# EAGLE design RetinaAdapterBoard (EAGLE 8.6.0)
COMPANY: ADAFRUIT INDUSTRIES; DRAWN: K. TOWNSEND; REV: D
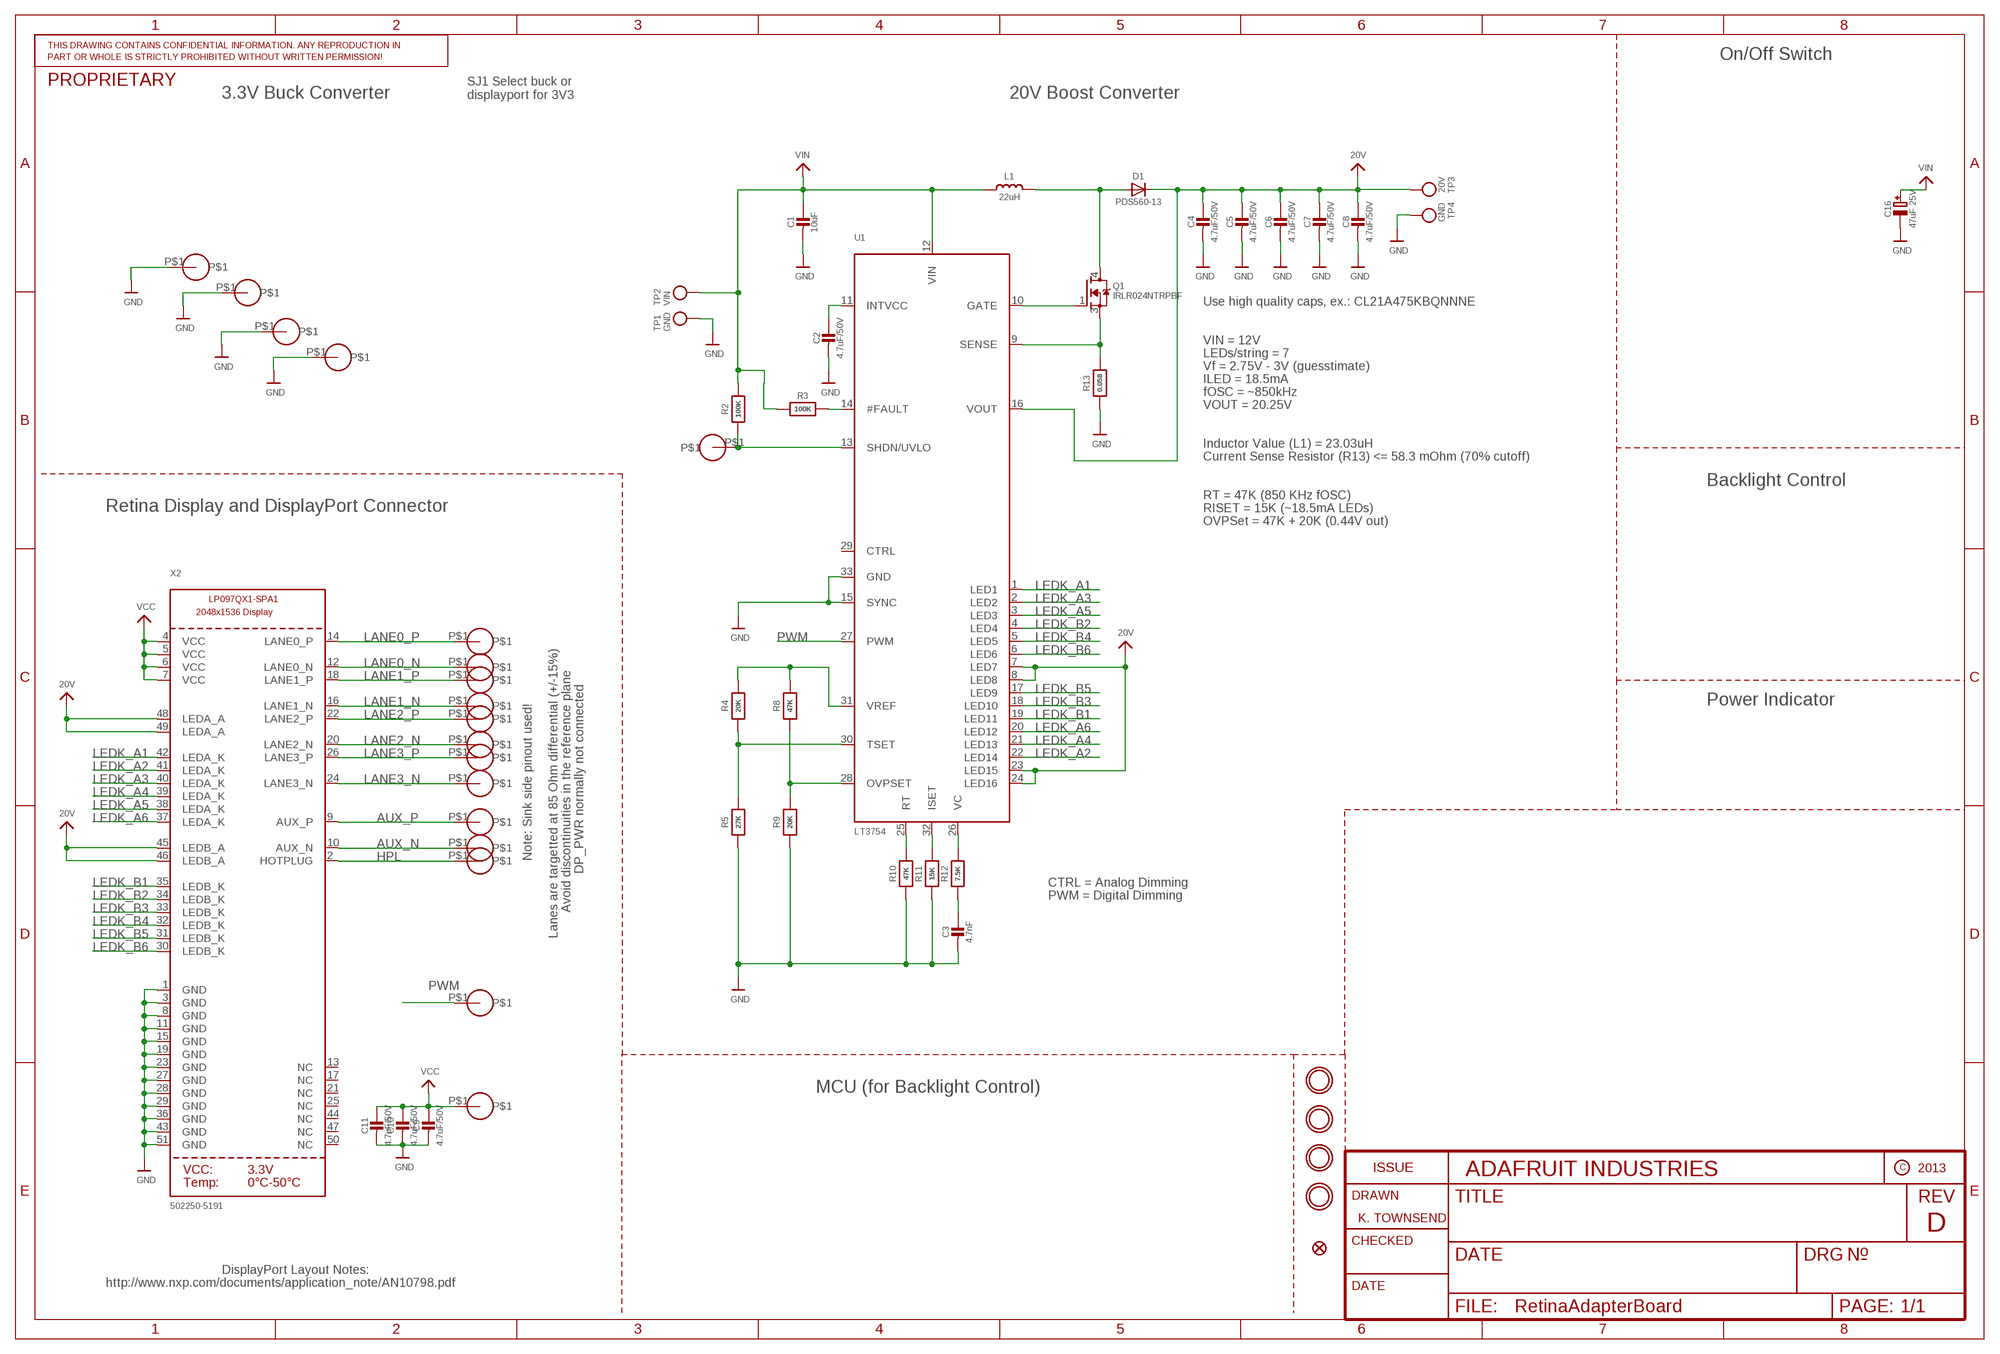
[diagram p0: schematic, sheet 1]

## Parts
C1  10uF  CAP_CERAMIC_0805  [_0805]
C2  4.7uF/50V  CAP_CERAMIC_0805  [_0805]
C3  4.7nF  CAP_CERAMIC_0805  [_0805]
C4  4.7uF/50V  CAP_CERAMIC_0805  [_0805]
C5  4.7uF/50V  CAP_CERAMIC_0805  [_0805]
C6  4.7uF/50V  CAP_CERAMIC_0805  [_0805]
C7  4.7uF/50V  CAP_CERAMIC_0805  [_0805]
C8  4.7uF/50V  CAP_CERAMIC_0805  [_0805]
C9  4.7uF/50V  CAP_CERAMIC_0805  [_0805]
C10  4.7uF/50V  CAP_CERAMIC_0805  [_0805]
C11  4.7uF/50V  CAP_CERAMIC_0805  [_0805]
C16  47uF 25V  CAP_ELECTROLYTICPANASONIC_C  [PANASONIC_C]
D1  PDS560-13  DIODEPOWERDI  [POWERDI-5]
FID3  FIDUCIAL""  [FIDUCIAL_1MM]
L1  22uH  INDUCTORCDRH5D28  [INDUCTOR_6X6MM_SUMIDA_CDRH5D28]
Q1  IRLR024NTRPBF  MOSFET-NDPAK  [DPAK]
R2  100K  RESISTOR_0805  [_0805]
R3  100K  RESISTOR_0805  [_0805]
R4  20K  RESISTOR_0805  [_0805]
R5  27K  RESISTOR_0805  [_0805]
R8  47K  RESISTOR_0805  [_0805]
R9  20K  RESISTOR_0805  [_0805]
R10  47K  RESISTOR_0805  [_0805]
R11  15K  RESISTOR_0805  [_0805]
R12  7.5K  RESISTOR_0805  [_0805]
R13  0.058  RESISTOR2512  [2512]
TP1  GND  TESTPOINTROUND1MM  [TESTPOINT_ROUND_1MM]
TP2  VIN  TESTPOINTROUND1MM  [TESTPOINT_ROUND_1MM]
TP3  20V  TESTPOINTROUND1MM  [TESTPOINT_ROUND_1MM]
TP4  GND  TESTPOINTROUND1MM  [TESTPOINT_ROUND_1MM]
U1  LT3754  VREG_LT3754  [QFN32_5MM]
U$1  SOLDERPAD  [SOLDERPAD]
U$4  SOLDERPAD  [SOLDERPAD]
U$9  SOLDERPAD  [SOLDERPAD]
U$10  SOLDERPAD  [SOLDERPAD]
U$11  MOUNTINGHOLE3.0THIN  [MOUNTINGHOLE_3.0_PLATEDTHIN]
U$13  SOLDERPAD  [SOLDERPAD]
U$15  SOLDERPAD  [SOLDERPAD]
U$32  MOUNTINGHOLE3.0THIN  [MOUNTINGHOLE_3.0_PLATEDTHIN]
U$33  MOUNTINGHOLE3.0THIN  [MOUNTINGHOLE_3.0_PLATEDTHIN]
U$34  MOUNTINGHOLE3.0THIN  [MOUNTINGHOLE_3.0_PLATEDTHIN]
U$43  SOLDERPAD  [SOLDERPAD]
U$46  SOLDERPAD  [SOLDERPAD]
U$47  SOLDERPAD  [SOLDERPAD]
U$48  SOLDERPAD  [SOLDERPAD]
U$49  SOLDERPAD  [SOLDERPAD]
U$50  SOLDERPAD  [SOLDERPAD]
U$51  SOLDERPAD  [SOLDERPAD]
U$52  SOLDERPAD  [SOLDERPAD]
U$53  SOLDERPAD  [SOLDERPAD]
U$54  SOLDERPAD  [SOLDERPAD]
U$55  SOLDERPAD  [SOLDERPAD]
U$57  SOLDERPAD  [SOLDERPAD]
X2  502250-5191  DISP_DISPLAYPORT_LP097QX1-SPA1HANDSOLDERING  [FPC_51PIN_502250-5191_EXT]

## Nets
20V: C4.1 C5.1 C6.1 C7.1 C8.1 D1.C TP3.P$1 U1.7(LED7) U1.8(LED8) U1.16(VOUT) U1.23(LED15) U1.24(LED16) X2.45(LEDB_A) X2.46(LEDB_A) X2.48(LEDA_A) X2.49(LEDA_A)
AUX_N: U$1.P$1 X2.10(AUX_N)
AUX_P: U$43.P$1 X2.9(AUX_P)
GND: C1.2 C2.2 C3.2 C4.2 C5.2 C6.2 C7.2 C8.2 C9.2 C10.2 C11.2 C16.- R5.1 R9.1 R10.1 R11.1 R13.1 TP1.P$1 TP4.P$1 U1.15(SYNC) U1.33(GND) U$10.P$1 U$13.P$1 U$15.P$1 U$55.P$1 X2.1(GND) X2.3(GND) X2.8(GND) X2.11(GND) X2.15(GND) X2.19(GND) X2.23(GND) X2.27(GND) X2.28(GND) X2.29(GND) X2.36(GND) X2.43(GND) X2.51(GND)
HPL: U$54.P$1 X2.2(HOTPLUG)
LANE0_N: U$52.P$1 X2.12(LANE0_N)
LANE0_P: U$53.P$1 X2.14(LANE0_P)
LANE1_N: U$50.P$1 X2.16(LANE1_N)
LANE1_P: U$51.P$1 X2.18(LANE1_P)
LANE2_N: U$48.P$1 X2.20(LANE2_N)
LANE2_P: U$49.P$1 X2.22(LANE2_P)
LANE3_N: U$46.P$1 X2.24(LANE3_N)
LANE3_P: U$47.P$1 X2.26(LANE3_P)
LEDK_A1: U1.1(LED1) X2.42(LEDA_K)
LEDK_A2: U1.22(LED14) X2.41(LEDA_K)
LEDK_A3: U1.2(LED2) X2.40(LEDA_K)
LEDK_A4: U1.21(LED13) X2.39(LEDA_K)
LEDK_A5: U1.3(LED3) X2.38(LEDA_K)
LEDK_A6: U1.20(LED12) X2.37(LEDA_K)
LEDK_B1: U1.19(LED11) X2.35(LEDB_K)
LEDK_B2: U1.4(LED4) X2.34(LEDB_K)
LEDK_B3: U1.18(LED10) X2.33(LEDB_K)
LEDK_B4: U1.5(LED5) X2.32(LEDB_K)
LEDK_B5: U1.17(LED9) X2.31(LEDB_K)
LEDK_B6: U1.6(LED6) X2.30(LEDB_K)
N$9: C2.1 U1.11(INTVCC)
N$10: R2.1 U1.13(SHDN/UVLO) U$9.P$1
N$11: R3.2 U1.14(#FAULT)
N$12: R12.2 U1.26(VC)
N$13: C3.1 R12.1
N$15: R4.1 R5.2 U1.30(TSET)
N$16: R4.2 R8.2 U1.31(VREF)
N$19: R8.1 R9.2 U1.28(OVPSET)
N$20: R10.2 U1.25(RT)
N$22: R11.2 U1.32(ISET)
N$23: Q1.3(S) R13.2 U1.9(SENSE)
N$24: Q1.1(G) U1.10(GATE)
N$25: D1.A1(A) D1.A2(A) L1.P$2 Q1.4(D)
PWM: U1.27(PWM) U$57.P$1
VCC: C9.1 C10.1 C11.1 U$4.P$1 X2.4(VCC) X2.5(VCC) X2.6(VCC) X2.7(VCC)
VIN: C1.1 C16.+ L1.P$1 R2.2 R3.1 TP2.P$1 U1.12(VIN)
Unconnected: U1.29(CTRL) X2.13(NC) X2.17(NC) X2.21(NC) X2.25(NC) X2.44(NC) X2.47(NC) X2.50(NC)

## Notes on the sheet
- On/Off Switch
- 3.3V Buck Converter
- SJ1 Select buck or
  displayport for 3V3
- 20V Boost Converter
- Use high quality caps, ex.: CL21A475KBQNNNE
- VIN = 12V
- LEDs/string = 7
- Vf = 2.75V - 3V (guesstimate)
- ILED = 18.5mA
- fOSC = ~850kHz
- VOUT = 20.25V
- Inductor Value (L1) = 23.03uH
- Current Sense Resistor (R13) <= 58.3 mOhm (70% cutoff)
- Backlight Control
- RT = 47K (850 KHz fOSC)
- Retina Display and DisplayPort Connector | RISET = 15K (~18.5mA LEDs)
- OVPSet = 47K + 20K (0.44V out)
- Power Indicator
- Note: Sink side pinout used!
- DP_PWR normally not connected
- CTRL = Analog Dimming
- PWM = Digital Dimming
- Avoid discontinuities in the reference plane
- Lanes are targetted at 85 Ohm differential (+/-15%)
- MCU (for Backlight Control)
- DisplayPort Layout Notes:
- http://www.nxp.com/documents/application_note/AN10798.pdf

## Library data of the parts
C1-C11 = microbuilder:CAP_CERAMIC: Ceramic Capacitors For new designs, use the packages preceded by an '_' character since they are more reliable: The following footprints should be used on most boards: _0402 - Standard footprint for regular board layouts _0603 - Standard footprint for regular board layouts _0805 - Standard footprint for regular board layouts _1206 - Standard footprint for regular board layouts For extremely tight-pitch boards where space is at a premium, the following 'micro-pitch' footprints can be used (smaller pads, no silkscreen outline, etc.): _0402MP - Micro-pitch footprint for very dense/compact boards _0603MP - Micro-pitch footprint for very dense/compact boards _0805MP - Micro-pitch footprint for very dense/compact boards _1206MP - Micro-pitch footprint for very dense/compact boards
C16 = microbuilder:CAP_ELECTROLYTIC: Electrolytic Capacitors SMT PANASONIC_C - Size C Panasonic Electrolytic Aluminum Capacitor 47µF 16V 20% Electrolytic Capacitor [Digikey: PCE3890TR-ND] PANASONIC_D - Size D Panasonic Electrolytic Aluminum Capacitor 100µF 25V 20% Electrolytic Capacitor [Digikey: PCE3898TR-ND] PTH 3.5 mm grid, 8 mm diameter ... 3.5 mm grid, 10 mm diameter ...
D1 = microbuilder:DIODE: Diode SMA Model Volts Amps Type Vf Ir Digikey # Notes SSA34-E3 40V 3A Schottky 480mV @ 3A 200uA @ 40V SSA34-E3/61TGITR-ND CDBA120-G 20V 1A Schottky 500mV @ 1A 500uA @ 20V 641-1014-6-ND REEL MBRA210 10V 2A Schottky 350mV @ 2A 700uA @ 10V MBRA210LT3 SOD-123 Model Volts Amps Type Vf Ir Order # Notes BAT54T1G 30V 200mA Schottky 800mV @ 200mA 2uA @ 25V BAT54T1GOSTR-ND B0530W 30V 500mA Schottky 430mV @ 500mA 130uA @ 30V B0530W-FDICT-ND REEL MBR120 20V 1A Schottky 340mV @ 1A MBR120VLSFT1GOSCT-ND SOD-323 Model Volts Amps Type Vf Ir Order # Notes PMEG2005EJ 20V 500mA Schottky 355mV @ 500mA 568-4110-1-ND ZLLS410 10V 570mA Schottky 380mV @ 570mA ZLLS410CT-ND 1N4148WS 75V 150mA Silicon/Simple 1V 1N4148WSFSCT-ND REEL SOD-523 Model Volts Amps Type Vf Ir Order # Notes BAT54XV2 30V 200mA Schottky 0.8V @ 100mA BAT54XV2CT-ND TB751S 30V 30mA Schottky RB751S-40TE61CT-ND SOT23-R/W (R = Solder Paste/Reflow Ovens, W = Hand-Soldering) Model Volts Amps Type Vf Ir Order # Notes BAT54FILM 40V 300mA Schottky 497-7162-1-ND POWERDI-5 Model Volts Amps Type Vf Ir Order # Notes PDS560 60V 5A Schottky 670mV @ 5A 150uA @ 60V PDS560DICT-ND
FID3 = microbuilder:FIDUCIAL: Fiducial Alignment Points Various fiducial points for machine vision alignment.; BOM: EXCLUDE
L1 = microbuilder:INDUCTOR: Inductors 0603: 10nH Ceramic Inductor - microwire antenna/RF (Digikey: 712-1434-2-ND) 0805: 560nH Ceramic Inductor - RF (Digikey: 553-1047-1-ND) 270nH Ceramic Inductor - Q = 40@250MHz, +-5%, 1 Ohm DC Resistance (Digikey: 535-10506-2-ND) 1007 (2518 Metric) SMT: 10µH 10% 250mOhm 820mA 1007 Inductor (Digikey: 587-2189-1-ND) 22µH 10% 500mOhm 580mA 1007 Inductor (Digikey: 587-2190-1-ND) 47µH 10% 950mOhm 420mA 1007 Inductor (Digikey: 587-2191-1-ND) 47µH 5% 100mOhm 1A 1008 Inductor (Digikey: 732-1816-1-ND) 5.0x5.0mm (Taiyo Yuden NR5040 Series) 6.8µH 20% 2.3A 64mOhm Inductor (Digikey: 587-2374-2-ND) 5.0x5.0mm (TDK VLC5045 Series) 4.7µH 20% 3.3A 34mOhm Inductor (Digikey: 445-6526-1-ND) 6.8µH 20% 2.7A 46mOhm Inductor (Digikey: 445-6527-1-ND) 6.0x6.0mm (TDK VLC6045 Series) 4.7µH 20% 3.8A 27mOhm Inductor (Digikey: 445-6538-2-ND) 6.8µH 20% 3A 41mOhm Inductor (Digikey: 445-6540-1-ND) 6.2µH 30% 2.2A 45mOhm Inductor (Digikey: SRR5028-6R2YCT-ND) - Not TDK VLC6045 but footprint should match 6.0x6.0mm (TDK SLF6045 Series) 6.8uH 30% 2A 33mOhm Inductor (Digikey: 445-4572-1-ND, Mouser: 810-SLF645T6R8N2R0PF) 6.0x6.0mm (Sumida CDRH5D28 Series) 6.2uH 30% 1.8A 45mOhm Inductor (Digikey: 308-1542-1-ND) Taiyo Yuden NR3015T2R2M - 2.2uH 20% 1.5A (Digikey: 587-1648-2-ND, Mouser: 963-NR3015T2R2M) - Used with TI TPS62172 CoilCraft RFID Transponder Coil - MA5532-AE (For use with AS3935 Lightning Sensor)
Q1 = microbuilder:MOSFET-N: N-Channel Mosfet LEGEND VDS: Voltage Drain-Source ID: Drain Current RDS(ON): Drain-Source On-State Resistance VGS(TH): Gate-Source Threshold Voltage CISS: Drain-Source Input Capacitance SOT-23 Name VDS ID RDS(ON) VGS(TH) CISS Order Number 2N7002E 60V 260mA 2.5 Ohm 2.5V @ 250uA 26.7pF @ 25V 2N7002ET1GOSTR-ND BSH103 30V 850mA 400 mOhm 400mV @ 1mA 83pF @ 24V BSH103,235-ND BSS138 60V 320mA 1.6 Ohm 1.5V @ 250uA 50pF @ 10V Mouser: 771-BSS138PW115 DMN2075U-7 20V 4.2A 38 mOhm 1V @ 250 uA 594.3pF @ 10V DMN2075U-7DICT-ND * BSS138 good choice for I2C level-shifting POWERPAK 1212-8 Name VDS ID RDS(ON) VGS(TH) CISS Order Number Si7308DN 60V 6A 58 mOhm 3V @ 250uA 665pF @ 15V SI7308DN-T1-E3CT-ND
R2-R5 R8-R13 = microbuilder:RESISTOR: Resistors For new designs, use the packages preceded by an '_' character since they are more reliable: The following footprints should be used on most boards: _0402 - Standard footprint for regular board layouts _0603 - Standard footprint for regular board layouts _0805 - Standard footprint for regular board layouts _1206 - Standard footprint for regular board layouts For extremely tight-pitch boards where space is at a premium, the following 'micro-pitch' footprints can be used (smaller pads, no silkscreen outline, etc.): _0402MP - Micro-pitch footprint for very dense/compact boards _0603MP - Micro-pitch footprint for very dense/compact boards _0805MP - Micro-pitch footprint for very dense/compact boards _1206MP - Micro-pitch footprint for very dense/compact boards
TP1-TP4 = microbuilder:TESTPOINT: Test Point Various test points for characterisation and PCB testing TESTPOINT_SMT - Compact Surface Mount Test Point [Digikey: 5016KTR-ND]
U1 = microbuilder:VREG_LT3754: LT3754 - 16-Channel x 50mA per LED Boost 6V to 40V Input Up to 45V Output (per channel) Single resistor sets current (10-50mA)
U$1 U$4 U$9 U$10 U$13 U$15 U$43 U$46-U$55 U$57 = solderpad:SOLDERPAD
U$11 U$32-U$34 = microbuilder:MOUNTINGHOLE: Mounting Hole For #2 screws (0.086"/2.18mm width, 0.094"/2.4mm hole) use 2.5mm; BOM: EXCLUDE
X2 = microbuilder:DISP_DISPLAYPORT_LP097QX1-SPA1: Connector: Molex 502250-5191

## Net classes
0 default: width 0.152 mm

## Board
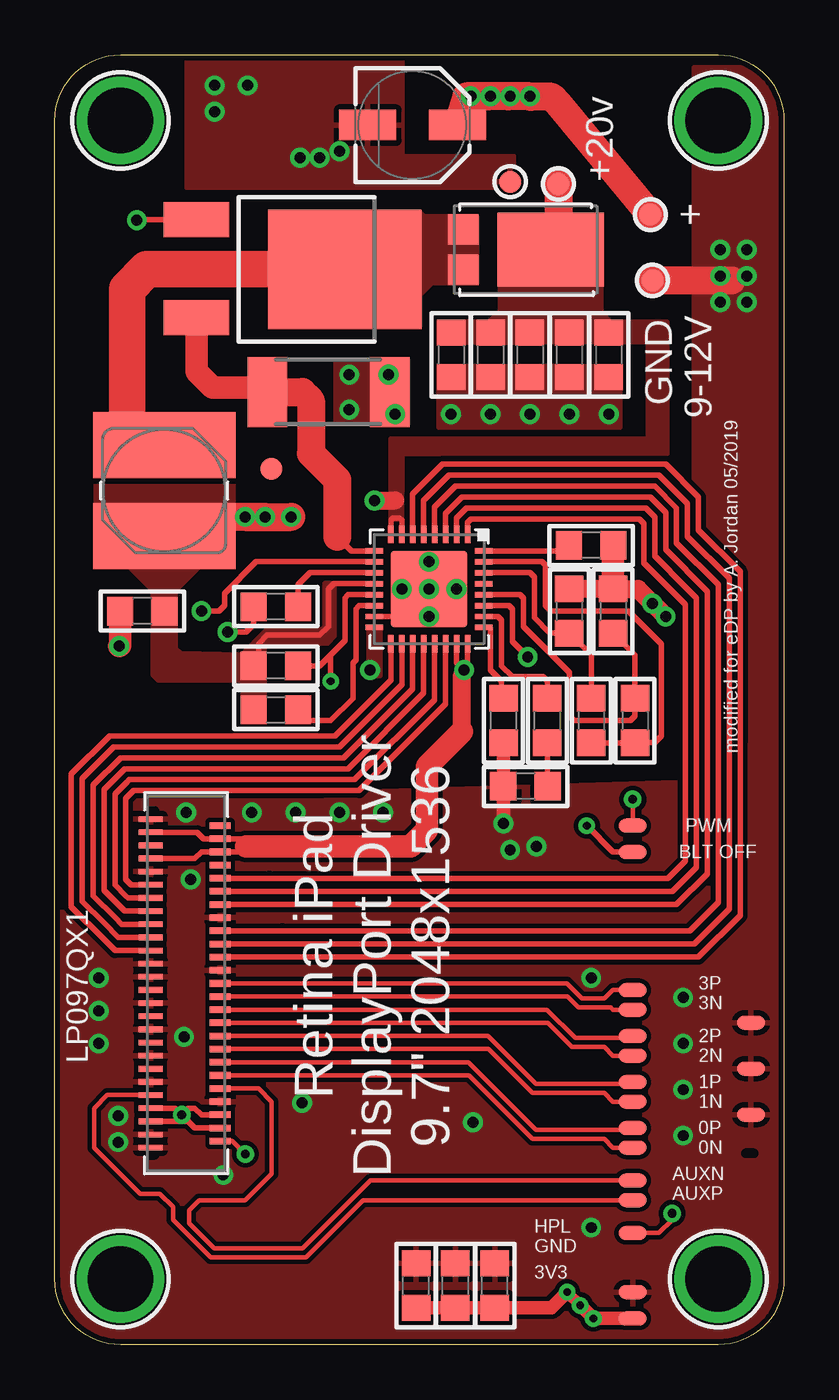
[diagram p1: board, top side]
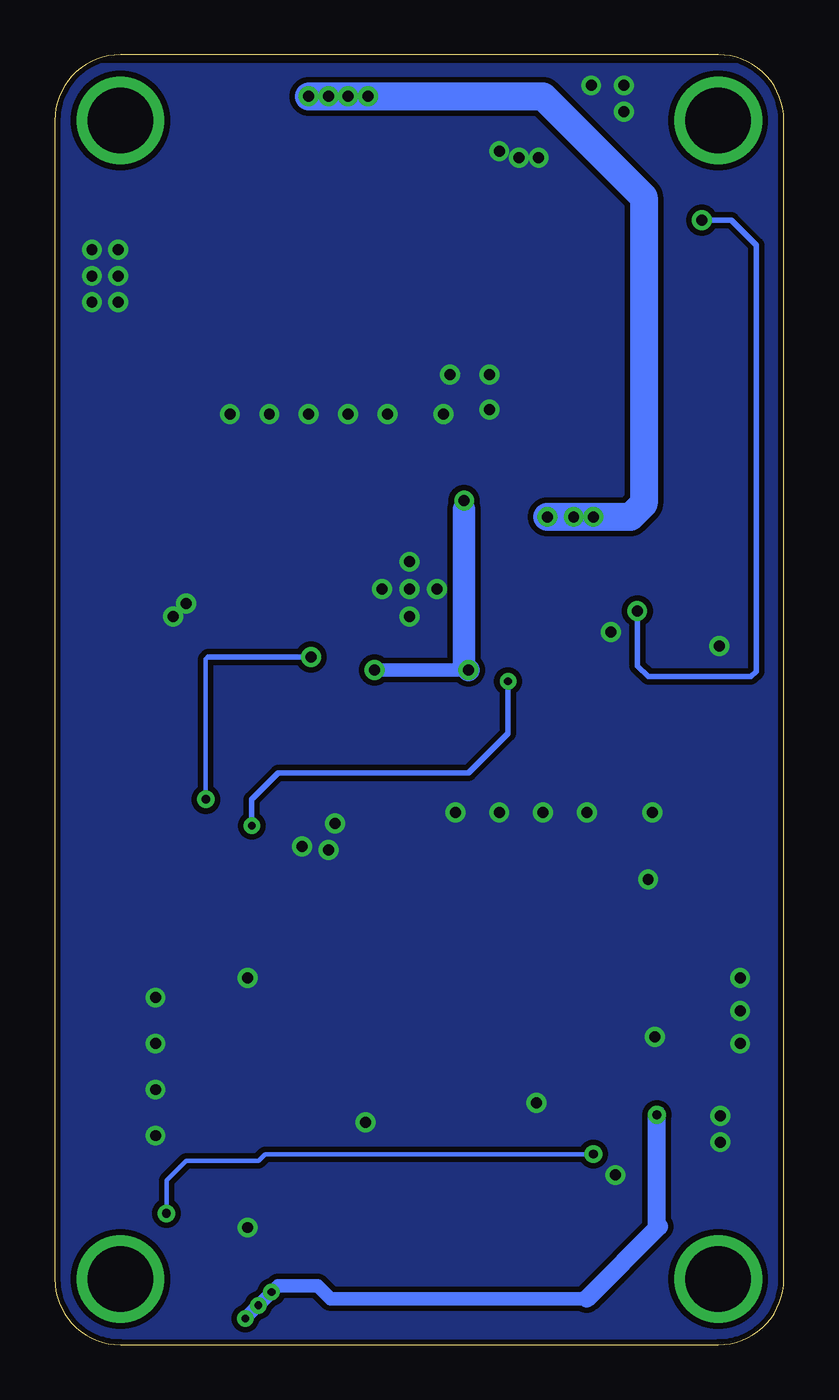
[diagram p2: board, bottom side, seen from below]

Size 33.3 x 58.9 mm. Coordinates in mm from the lower left corner, seen from the top.
Outline: 0,3 0,55.9 arc-90 3,58.9 30.3,58.9 arc-90 33.3,55.9 33.3,3 arc-90 30.3,0 3,0 arc-90 0,3
Copper layers (1*16): Top 0.035mm / dielectric 1.5mm / Bottom 0.035mm
Design rules "adafruit": minimum track width 8mil, minimum drill 15.5mil, track to track 8mil, track to pad 8mil, pad to pad 8mil, via to via 8mil, smd to smd 8mil, copper to edge 10mil, drill to drill 8mil, minimum pad ring 10mil, minimum via ring 8mil, stop-mask expansion 4mil, vias tented up to drill 20mil, thermal gap 10mil
tRestrict: area 31.5,8.7 to 31.9,8.8; area 4.2,17.1 to 4.5,17.1; area 4.2,24.3 to 4.6,24.4; area 4.2,9.3 to 4.6,9.4; area 4.2,8.7 to 4.6,8.7

### Footprints (pad centres in the part's own frame; a part is rotated, then mirrored left to right if it is on the bottom)
_0805 = smd 1.2 x 1.3: 1 -1.016,0; 2 1.016,0
PANASONIC_C = smd 2.6 x 1.4: + 2.05,0; - -2.05,0
POWERDI-5 = smd 1.39 x 1.4: A1 -0.92,-2.84; A2 0.92,-2.84 | smd 3.36 x 4.86: C 0,1.142
FIDUCIAL_1MM = smd 1 x 1: 1 0,0
INDUCTOR_6X6MM_SUMIDA_CDRH5D28 = smd 3 x 6.5: P$1 -2.075,0; P$2 2.075,0
DPAK = smd 1.6 x 2.997: 1 -2.261,-4.928; 3 2.21,-4.928 | smd 5.452 x 7: 4 0,1.853
2512 = smd 1.8 x 3.2: 1 -2.8,0; 2 2.8,0
TESTPOINT_ROUND_1MM = smd 1 x 1: P$1 0,0
QFN32_5MM = smd 0.8 x 0.25: 1 -2.5,1.75; 2 -2.5,1.25; 3 -2.5,0.75; 4 -2.5,0.25; 5 -2.5,-0.25; 6 -2.5,-0.75; 7 -2.5,-1.25; 8 -2.5,-1.75; 17 2.5,-1.75; 18 2.5,-1.25; 19 2.5,-0.75; 20 2.5,-0.25; 21 2.5,0.25; 22 2.5,0.75; 23 2.5,1.25; 24 2.5,1.75 | smd 0.25 x 0.8: 9 -1.75,-2.5; 10 -1.25,-2.5; 11 -0.75,-2.5; 12 -0.25,-2.5; 13 0.25,-2.5; 14 0.75,-2.5; 15 1.25,-2.5; 16 1.75,-2.5; 25 1.75,2.5; 26 1.25,2.5; 27 0.75,2.5; 28 0.25,2.5; 29 -0.25,2.5; 30 -0.75,2.5; 31 -1.25,2.5; 32 -1.75,2.5 | smd 3.5 x 3.5: 33 0,0
SOLDERPAD = smd 0.635 x 1.27: P$1 0,0
MOUNTINGHOLE_3.0_PLATEDTHIN = drill 3 pad 3.6: P$1 0,0
FPC_51PIN_502250-5191_EXT = smd 0.26 x 1.1: 1 7.5,-1.625; 3 6.9,-1.625; 5 6.3,-1.625; 7 5.7,-1.625; 9 5.1,-1.625; 11 4.5,-1.625; 13 3.9,-1.625; 15 3.3,-1.625; 17 2.7,-1.625; 19 2.1,-1.625; 21 1.5,-1.625; 23 0.9,-1.625; 25 0.3,-1.625; 27 -0.3,-1.625; 29 -0.9,-1.625; 31 -1.5,-1.625; 33 -2.1,-1.625; 35 -2.7,-1.625; 37 -3.3,-1.625; 39 -3.9,-1.625; 41 -4.5,-1.625; 43 -5.1,-1.625; 45 -5.7,-1.625; 47 -6.3,-1.625; 49 -6.9,-1.625; 51 -7.5,-1.625 | smd 0.3 x 0.95: 2 7.2,1.55; 4 6.6,1.55; 6 6,1.55; 8 5.4,1.55; 10 4.8,1.55; 12 4.2,1.55; 14 3.6,1.55; 16 3,1.55; 18 2.4,1.55; 20 1.8,1.55; 22 1.2,1.55; 24 0.6,1.55; 26 0,1.55; 28 -0.6,1.55; 30 -1.2,1.55; 32 -1.8,1.55; 34 -2.4,1.55; 36 -3,1.55; 38 -3.6,1.55; 40 -4.2,1.55; 42 -4.8,1.55; 44 -5.4,1.55; 46 -6,1.55; 48 -6.6,1.55; 50 -7.2,1.55

### Placement (x,y rotation side)
C1  4,33.5 180 top
C2  10.1,33.7 180 top
C3  21.5,25.5 180 top
C4  18.1,45.2 270 top
C5  19.9,45.2 270 top
C6  21.7,45.2 270 top
C7  23.5,45.2 270 top
C8  25.3,45.2 270 top
C9  18.3,2.7 90 top
C10  20.1,2.7 90 top
C11  16.5,2.7 90 top
C16  16.34,55.69 0 top
D1  21.5,50 270 top
FID3  9.9,40 0 top
L1  5,39 90 top
Q1  11.4,49.1 270 top
R2  10.1,31 180 top
R3  10.1,29 0 top
R4  24.5,28.5 270 top
R5  23.5,33.5 270 top
R8  26.5,28.5 270 top
R9  25.5,33.5 270 top
R10  20.5,28.5 90 top
R11  24.5,36.5 180 top
R12  22.5,28.5 90 top
R13  12.5,43.5 180 top
TP1  20.8,53.1 90 top
TP2  27.2,51.6 90 top
TP3  23,53 90 top
TP4  27.3,48.6 90 top
U1  17.1,34.5 270 top
U$1  26.4,7.5 90 top
U$4  26.4,1.2 90 top
U$9  26.4,22.5 90 top
U$10  31.8,14.7 90 top
U$11  30.3,3 0 top
U$13  31.8,12.6 90 top
U$15  31.8,10.5 90 top
U$32  30.3,55.9 0 top
U$33  3,55.9 0 top
U$34  3,3 0 top
U$43  26.4,6.6 90 top
U$46  26.4,15.3 270 top
U$47  26.4,16.2 90 top
U$48  26.4,13.2 90 top
U$49  26.4,14.1 90 top
U$50  26.4,11.1 90 top
U$51  26.4,12 90 top
U$52  26.4,9 90 top
U$53  26.4,9.9 90 top
U$54  26.4,5.1 90 top
U$55  26.4,2.4 90 top
U$57  26.4,23.7 90 top
X2  6,16.5 270 top

### Tracks (layer width: path | path; a pad name or v marks a point on that pad's centre or on a via)
20V  (via drill 0.5)
  Top 0.25: X2.49 6.5,23.4 6.8,23.1 X2.48 | X2.45 6.4,22.2 6.7,22.5 X2.46
  Top 0.254: X2.46 8.75,22.5 8.75,22.75 8.65,23.1 | X2.48 9.15,23.1 9.5,22.75 | 18.35,30.65 18.6,30.6 | U1.8 15.35,37.65 15.45,37.75 15.75,37.75 15.85,37.65 U1.7 | U1.24 18.85,30.95 v18.7,30.8 18.35,31.15 U1.23
  Top 0.61: v18.7,30.8 18.7,30.7 18.6,30.6
  Top 0.813: 18.6,28 18.6,30.6 | v14.6,38.55 15.55,38.55
  Top 1.016: 8.75,22.75 9.5,22.75 16.25,22.75 17,23.5 17,26.4 18.6,28
  Top 1.27: TP3.P$1 23,50.36 D1.C
  Bottom 0.61: v18.7,30.8 v14.4,30.8
  Bottom 0.813: 14.6,38.15 v14.6,38.55
  Bottom 1.016: 14.6,38.15 14.6,31 v14.4,30.8
  pour Top (isolate 0.254, no thermals): 17.55,45.75 27.1,45.8 27.1,41.35 15.35,41.35 15.35,37.7 15.85,37.7 15.85,40.7 27.95,40.7 27.95,46.7 25.35,46.7 24.95,47.1 24.95,51.55 20.35,51.55 20.35,47.2 19.85,46.7 17.55,46.7
  pour Top (isolate 0.254, no thermals): 14.35,32.75 14.85,32.75 14.85,30.55 14.35,30.55
AUX_N
  Top 0.203: U$1.P$1 14.41,7.5 11.32,4.4 7.28,4.4 6.14,5.54 6.14,6.14 6.6,6.6 8.7,6.6 9.9,7.8 9.9,11.1 9.3,11.7 X2.10
AUX_P
  Top 0.203: U$43.P$1 14.09,6.6 11.48,4 7.12,4 5.4,5.71 5.4,6.3 4.8,6.9 3.9,6.9 1.8,9 1.8,10.8 2.4,11.4 X2.9
GND  (via drill 0.5)
  Top 0.254: C2.2 9.08,32.88 8.75,32.55 v7.9,32.55 | U1.15 v17.1,33.25 | v11.2,54.2 11.2,54.1 11.1,54
  Top 0.508: v27.3,33.85 v27.9,33.25
  Top 0.61: R10.1 20.5,25.52 C3.2 20.48,23.82 v20.5,23.8
  Top 0.813: v27.9,33.25 26.63,34.52 R9.1 R5.1
  Top 1.016: C1.2 2.98,31.93 v2.95,31.9 | R9.1 25.5,36.48 R11.1
  Top 1.27: TP4.P$1 30.9,48.6
  other vias: 22,22.75 2,16.75 2,15.25 2,13.75 6,24.3 18.1,42.5 19.9,42.5 21.7,42.5 23.5,42.5 13.45,44.3 13.45,42.7 9,24.3 11,24.3 13,24.3 15,24.3 25.3,42.5 17.1,34.5 17.1,35.75 15.85,34.5 18.35,34.5 2.9,10.45 2.9,9.25 7.7,7.75 28.7,15.85 28.7,13.75 28.7,11.65 28.7,9.55 24.5,5.35 5.9,14.05 6.2,21.25 24.5,16.75 11.3,11.05 19.1,10.15 15.25,44.3 15.55,42.5 12.1,54.2 13,54.5 7.3,57.5 7.3,56.3 8.8,57.5 30.4,50 30.4,48.8 30.4,47.6 31.6,50 31.6,48.8 31.6,47.6 20.8,22.6
  pour Bottom (isolate 0.254): 0,58.4 33.3,58.4 33.3,0 0,0
  pour Top (isolate 0.254, no thermals): 17.55,44.65 25.8,44.65 25.8,41.9 17.55,41.9
  pour Top (isolate 0.254, no thermals): 12.85,44.95 16.1,44.95 16.1,42.05 12.85,42.05
  pour Top (isolate 0.21): 0,3 0,24.8 29.2,25.7 29.2,58.3 33.3,58.3 33.3,3 arc-90 30.3,0 3,0 arc-90
  pour Top: 6,62.1 6,52.8 21,52.8 21,54.3 15.9,54.3 15.9,62.4 6,62.4
HPL  (via drill 0.39)
  Top 0.203: X2.2 8.1,9.3 v8.7,8.7 | v28.2,6 28.2,5.7 27.6,5.1 U$54.P$1
  Bottom 0.203: v8.7,8.7 23.7,8.7 24,8.4 27.3,8.4 28.2,7.5 v28.2,6
LANE0_N
  Top 0.203: X2.12 18.91,12.3 21.82,9.4 25.1,9.4 25.5,9 U$52.P$1
LANE0_P
  Top 0.203: X2.14 18.89,12.9 21.98,9.8 26.3,9.8 U$53.P$1
LANE1_N
  Top 0.203: X2.16 19.81,13.5 21.82,11.5 25.1,11.5 25.5,11.1 U$50.P$1
LANE1_P
  Top 0.203: X2.18 19.79,14.1 21.98,11.9 26.3,11.9 U$51.P$1
LANE2_N
  Top 0.203: X2.20 22.51,14.7 23.62,13.6 25.1,13.6 25.5,13.2 U$48.P$1
LANE2_P
  Top 0.203: X2.22 22.49,15.3 23.78,14 26.3,14 U$49.P$1
LANE3_N
  Top 0.203: X2.24 23.41,15.9 23.92,15.4 25.4,15.4 25.5,15.3 U$46.P$1
LANE3_P
  Top 0.203: X2.26 23.39,16.5 24.08,15.8 25.1,15.8 25.5,16.2 U$47.P$1
LEDK_A1
  Top 0.254: X2.42 9.8,21.3 17.75,21.3 28,21.3 28.8,22.1 28.8,27.5 28.8,33.8 26.9,35.7 26.9,37.5 26.7,37.7 19,37.7 18.85,37.55 U1.1
LEDK_A2
  Top 0.254: X2.41 3.5,21 3.25,21.25 3.25,24.95 3.6,25.3 12.2,25.3 13.9,25.3 17.85,29.25 U1.22
LEDK_A3
  Top 0.254: X2.40 9.95,20.7 17.75,20.7 28.2,20.7 29.3,21.8 29.3,27.5 29.3,34.1 28.85,34.55 27.4,36 27.4,37.8 27,38.2 18.8,38.2 18.35,37.75 U1.2
LEDK_A4
  Top 0.254: X2.39 3.35,20.4 3.25,20.5 2.75,21 2.75,25.15 3.3,25.7 3.4,25.8 12.2,25.8 13.7,25.8 17.35,29.45 U1.21
LEDK_A5
  Top 0.254: X2.38 10.1,20.1 17.75,20.1 28.4,20.1 29.8,21.5 29.8,27.5 29.8,34.4 27.9,36.3 27.9,38 27.2,38.7 18.6,38.7 17.85,37.95 U1.3
LEDK_A6
  Top 0.254: X2.37 3.2,19.8 3,20 2.25,20.75 2.25,25.35 3.1,26.2 3.2,26.3 12.2,26.3 13.4,26.3 16.85,29.75 U1.20
LEDK_B1
  Top 0.254: X2.35 3.05,19.2 2.75,19.5 1.75,20.5 1.75,25.55 3,26.8 12.2,26.8 13.2,26.8 16.35,29.95 U1.19
LEDK_B2
  Top 0.254: X2.34 10.4,18.9 17.7,18.9 29,18.9 30.3,20.2 30.3,27.5 30.3,34.7 28.4,36.6 28.4,38.2 27.4,39.2 18.3,39.2 17.35,38.25 U1.4
LEDK_B3
  Top 0.254: X2.33 2.9,18.6 2.25,19.25 1.25,20.25 1.25,25.85 2.7,27.3 12.2,27.3 13,27.3 15.85,30.15 U1.18
LEDK_B4
  Top 0.254: X2.32 10.55,18.3 17.7,18.3 29.2,18.3 30.8,19.9 30.8,27.5 30.8,35 28.9,36.9 28.9,38.4 27.6,39.7 18,39.7 16.85,38.55 U1.5
LEDK_B5
  Top 0.254: X2.31 2.75,18 2.25,18.5 0.75,20 0.75,26.05 2.5,27.8 12.2,27.8 12.8,27.8 15.35,30.35 U1.17
LEDK_B6
  Top 0.254: X2.30 10.7,17.7 17.7,17.7 29.4,17.7 31.3,19.6 31.3,27.5 31.3,35.3 29.4,37.2 29.4,38.7 27.9,40.2 17.7,40.2 16.35,38.85 U1.6
N$9
  Top 0.254: U1.11 11.65,35.25 11.15,34.75 11.12,34.72 C2.1
N$10  (via drill 0.35)
  Top 0.254: U1.13 13.4,34.25 13.25,34.1 13.25,32.15 12.6,31.5 | 12.6,31.5 12.1,31 R2.1 | 12.6,31.5 v12.6,30.3 | U$9.P$1 25.5,22.5 v24.3,23.7
  Bottom 0.254: v12.6,30.3 12.6,27.9 14.4,26.1 23.1,26.1 24.3,24.9 v24.3,23.7
N$11
  Top 0.254: U1.14 13.9,33.75 13.75,33.6 13.75,31.26 13.62,31.12 13.62,29.52 12.6,28.5 11.62,28.5 R3.2
N$12
  Top 0.254: U1.26 20.25,33.25 20.4,33.1 20.4,31 20.9,30.5 22.3,30.5 22.5,30.3 R12.2
N$13
  Top 0.254: R12.1 22.5,25.52 C3.1
N$15
  Top 0.254: R4.1 24.5,31.48 R5.2 23.48,32.5 22.6,32.5 21.9,33.2 21.9,35.05 21.7,35.25 U1.30
N$16
  Top 0.254: R4.2 R8.2 26.52,27.5 27.4,27.5 27.7,27.8 27.7,32 26.2,33.5 22.65,33.5 22.4,33.75 22.4,35.6 22.25,35.75 U1.31
N$19
  Top 0.254: R9.2 26.5,31.48 R8.1 26.5,28.7 26.3,28.5 23.7,28.5 23.5,28.7 23.5,30.7 22.7,31.5 21.4,32.8 21.4,34.1 21.25,34.25 U1.28
N$20
  Top 0.254: U1.25 19.85,32.75 19.9,32.7 19.9,30.8 20.4,30.3 20.4,29.62 R10.2
N$22
  Top 0.254: U1.32 23.23,36.25 R11.2
N$23
  Top 0.254: U1.9 13.55,36.25 12.9,36.9
  Top 1.016: Q1.3 6.47,44.43 7.2,43.7 9.5,43.7 R13.2
  Top 1.27: R13.2 11.3,43.5 11.7,43.1 11.7,40.7 12.9,39.5 12.9,36.9
N$24  (via drill 0.5)
  Top 0.254: Q1.1 3.76,51.36 v3.75,51.35 | U1.10 9.2,35.75 7.75,34.3 7.75,33.75 7.5,33.5 v6.7,33.5
  Bottom 0.254: v3.75,51.35 2.4,51.35 1.25,50.2 1.25,35.05 1.25,30.75 1.5,30.5 6.2,30.5 6.7,31 v6.7,33.5
N$25
  Top 1.676: Q1.4 4.2,49.1 3.3,48.2 3.3,41.8 4,41.1 4.97,41.1 L1.P$2
  pour Top (isolate 0.254, no thermals): 19.25,51.5 19.25,48.5 17.2,48.5 16.65,47.95 16.65,46.5 9.9,46.5 9.9,51.7 16.65,51.7 16.85,51.5
PWM  (via drill 0.39, 0.5)
  Top 0.203: U$57.P$1 v26.4,24.9
  Top 0.254: U1.27 20.75,33.75 20.9,33.6 20.9,32.1 v21.6,31.4
  Bottom 0.203: v26.4,24.9 26.4,31.3 26.3,31.4
  Bottom 0.254: v21.6,31.4 26.3,31.4
VCC  (via drill 0.35, 0.4)
  Top 0.25: X2.6 6.7,10.5 6.4,10.8 6.1,10.8 v5.8,10.5 | X2.5 5.8,10.2 | 5.8,10.2 6.1,10.2 6.4,9.9 X2.4 | v5.8,10.5 5.8,10.2 | X2.7 5.5,10.8 v5.8,10.5
  Top 0.508: v23.4,2.4 v24,1.8
  Top 0.61: v24,1.8 v24.6,1.2 U$4.P$1 | C11.1 C9.1 C10.1 22.68,1.68 v23.4,2.4
  Bottom 0.61: 9,2.1 20.7,2.1 21.3,2.7 23.1,2.7 v24.6,1.2
  Bottom 0.813: 9,2.1 5.7,5.4 5.8,5.5 v5.8,10.5
VIN  (via drill 0.5)
  Top 0.254: U1.12 12.75,34.75 12.5,34.5 12.5,32.8 12.1,32.4 9.7,32.4 9.3,32 9.3,31.22 R2.2
  Top 0.508: v19,57 19.8,57 | v19.9,57 20.7,57 v20.8,57
  Top 1.27: v9.6,37.8 5.88,37.8 L1.P$1 | TP2.P$1 23,56.67 22.7,56.97 21.73,56.97 v21.7,57 20.7,57 19.8,57 18.8,57 C16.+ | v8.7,37.8 v9.6,37.8 | v9.6,37.8 v10.8,37.8
  Bottom 1.27: v21.7,57 10.99,57 6.4,52.41 6.4,38.4 7,37.8 v10.8,37.8
  pour Top (isolate 0.254, no thermals): 1.9,40.3 1.9,35.55 3.4,35.55 4.5,34.45 4.5,30.6 4.75,30.35 8.6,30.35 8.6,28.45 9.55,28.45 9.55,31.85 9.75,32.05 12.45,32.05 12.75,32.35 12.75,34.75 12.35,34.75 12.35,32.8 12.15,32.6 9.65,32.6 8.55,31.5 5.75,31.55 5.5,31.8 5.5,34.45 6.6,35.55 8.15,35.55 8.15,40.3

### Text on the board
tPlace: +20v | + | GND | 9-12V | modified for eDP by A. Jordan 05/2019 | PWM | BLT OFF | Retina iPad / DisplayPort Driver / 9.7" 2048x1536 | LP097QX1 | 3P | 3N | 2P | 2N | 1P | 1N | 0P | 0N | AUXN | AUXP | HPL | GND | 3V3